# EAGLE schematic FV1 DSP pedal (EAGLE 9.3.0)
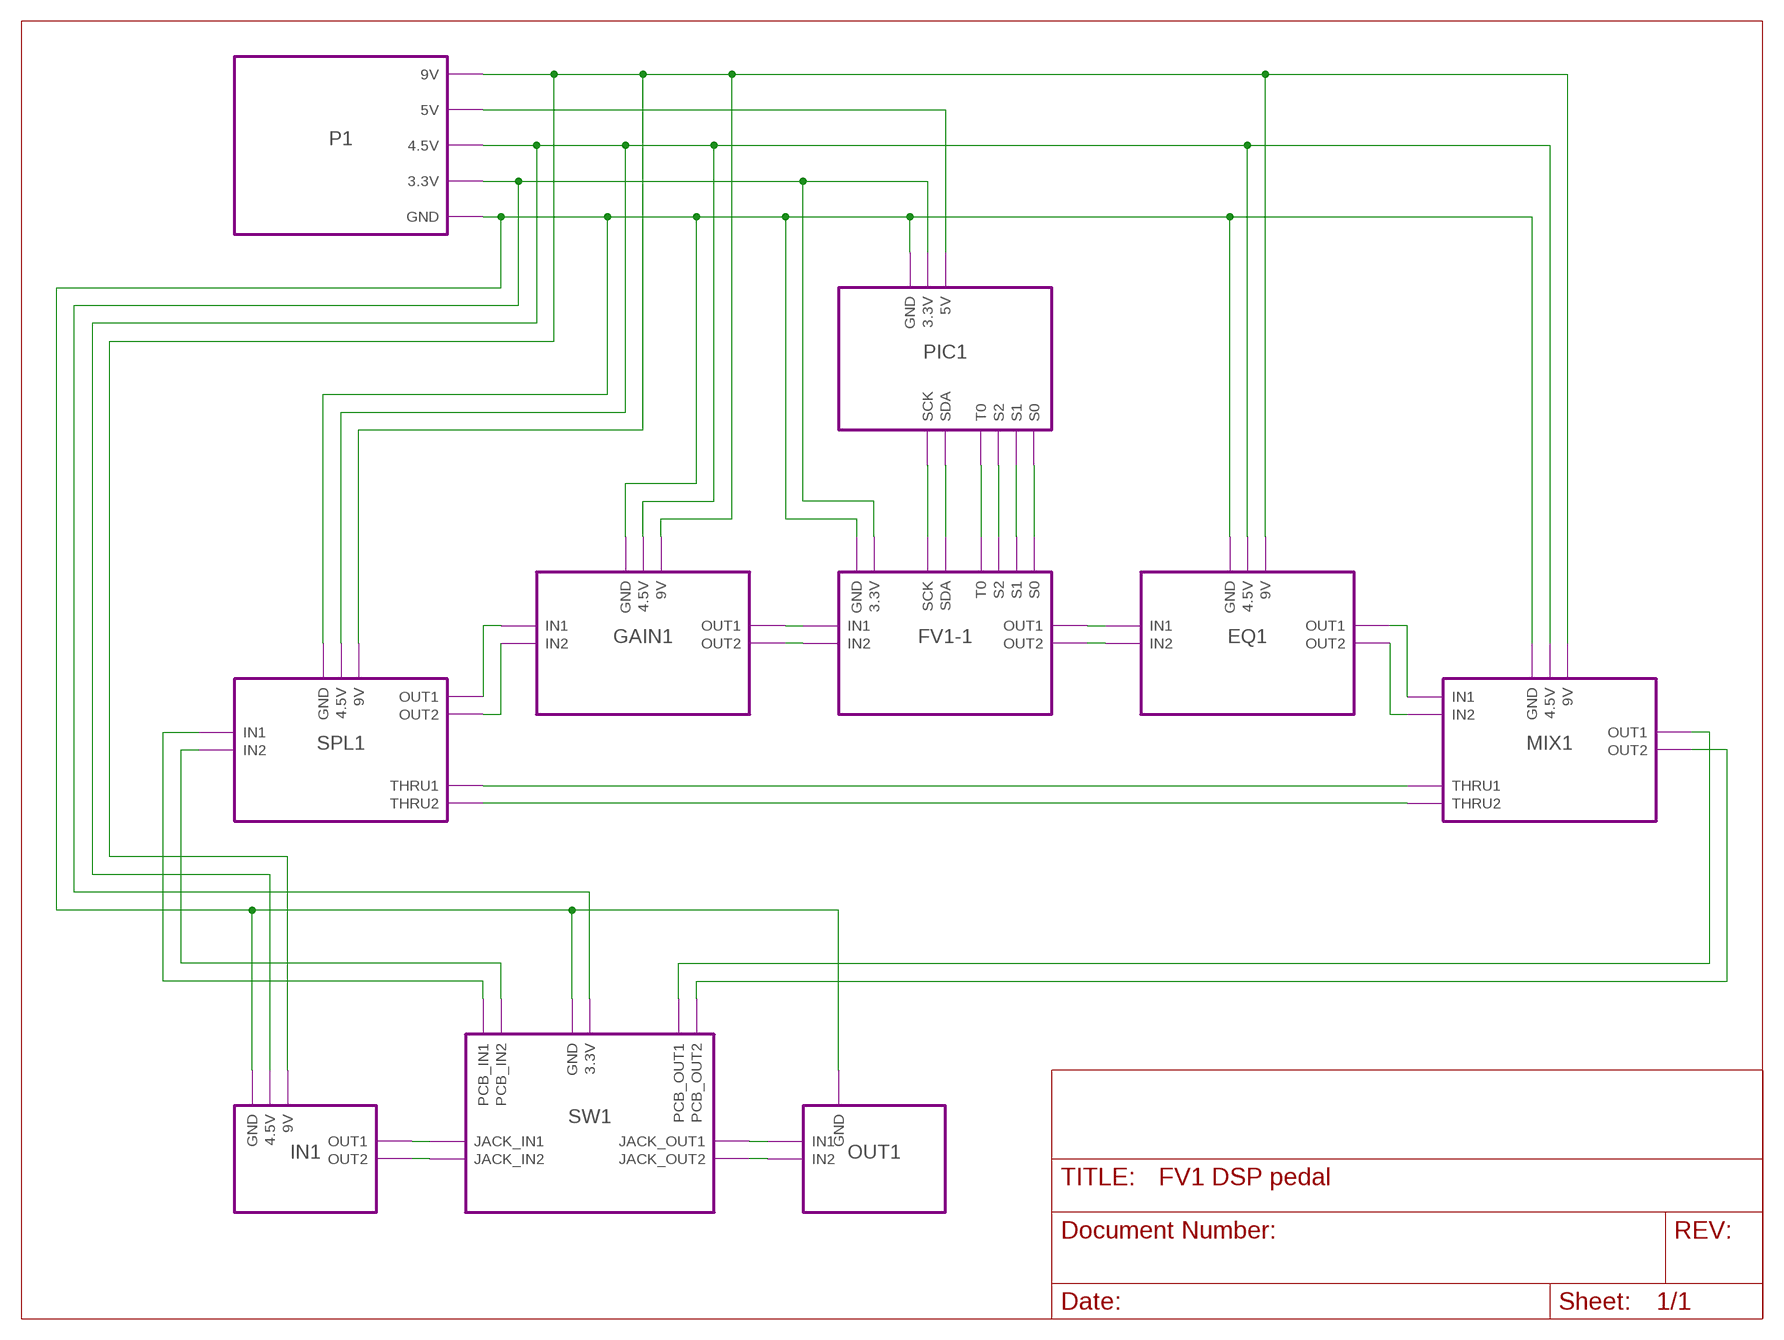
[diagram p0: schematic, sheet 1]

## Module instances
EQ1 = EQ
FV1-1 = FV1
PIC1 = PIC
MIX1 = MIX
GAIN1 = GAIN
OUT1 = OUTPUT
P1 = POWER
SW1 = SWITCHING
IN1 = INPUT
SPL1 = SPLIT

## Nets
3.3V: port SW1.3.3V P1.3.3V PIC1.3.3V FV1-1.3.3V
4.5V: port P1.4.5V MIX1.4.5V EQ1.4.5V SPL1.4.5V IN1.4.5V GAIN1.4.5V
9V: port P1.9V MIX1.9V EQ1.9V SPL1.9V IN1.9V GAIN1.9V
GND: port SW1.GND P1.GND PIC1.GND MIX1.GND EQ1.GND SPL1.GND FV1-1.GND IN1.GND GAIN1.GND OUT1.GND
N$1: port MIX1.THRU1 SPL1.THRU1
N$2: port MIX1.THRU2 SPL1.THRU2
N$3: port MIX1.IN1 EQ1.OUT1
N$4: port EQ1.OUT2 MIX1.IN2
N$5: port SPL1.OUT2 GAIN1.IN2
N$6: port GAIN1.IN1 SPL1.OUT1
N$7: port IN1.OUT1 SW1.JACK_IN1
N$8: port GAIN1.OUT1 FV1-1.IN1
N$9: port FV1-1.IN2 GAIN1.OUT2
N$10: port FV1-1.OUT1 EQ1.IN1
N$11: port EQ1.IN2 FV1-1.OUT2
N$12: port SW1.JACK_IN2 IN1.OUT2
N$13: port SW1.JACK_OUT1 OUT1.IN1
N$14: port OUT1.IN2 SW1.JACK_OUT2
N$15: port P1.5V PIC1.5V
N$17: port SW1.PCB_IN1 SPL1.IN1
N$18: port SW1.PCB_IN2 SPL1.IN2
N$19: port MIX1.OUT2 SW1.PCB_OUT2
N$20: port SW1.PCB_OUT1 MIX1.OUT1
N$22: port PIC1.T0 FV1-1.T0
N$23: port PIC1.S2 FV1-1.S2
N$25: port FV1-1.S1 PIC1.S1
N$26: port PIC1.S0 FV1-1.S0
N$27: port PIC1.SCK FV1-1.SCK
N$28: port PIC1.SDA FV1-1.SDA

## Library data of the parts

## Module EQ
Ports: IN1(in) IN2(in) OUT1(out) OUT2(out) 9V(pwr) 4.5V(pwr) GND(pwr)
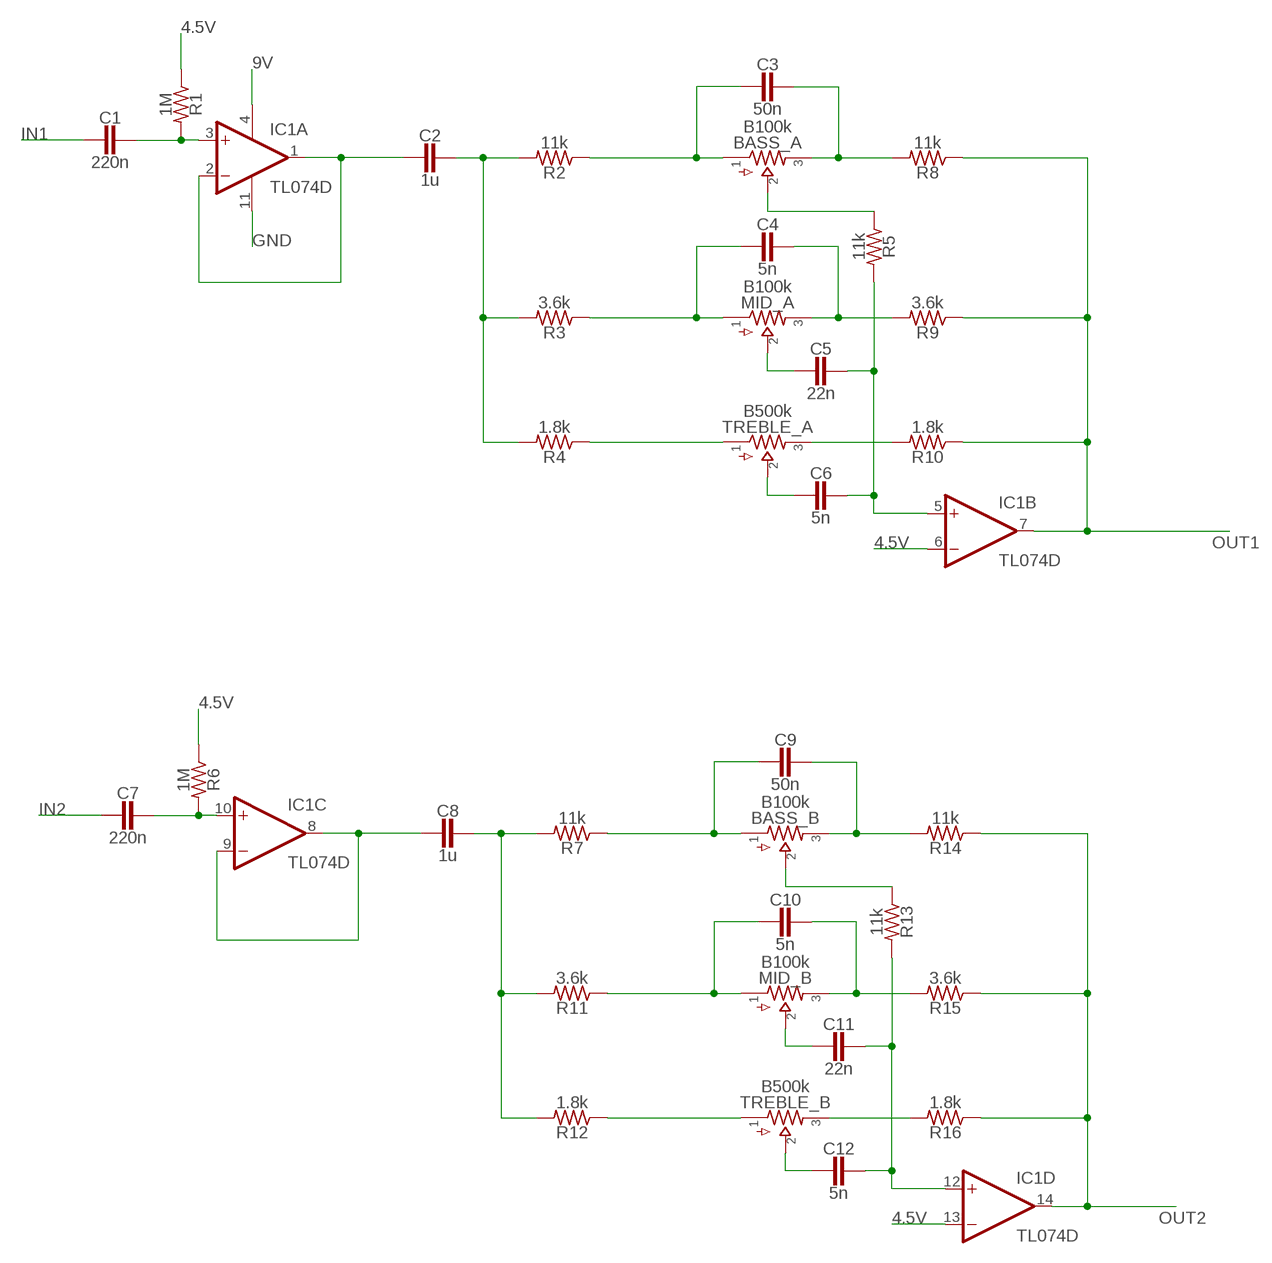
[diagram p1: schematic, module EQ, sheet 1]

### Parts
BASS  B100k  DUALGANG.2  [16MM_DUALGANG]
C1  220n  CAP0603  [RESISTOR_R0603]
C2  1u  CAP0603  [RESISTOR_R0603]
C3  50n  CAP0603  [RESISTOR_R0603]
C4  5n  CAP0603  [RESISTOR_R0603]
C5  22n  CAP0603  [RESISTOR_R0603]
C6  5n  CAP0603  [RESISTOR_R0603]
C7  220n  CAP0603  [RESISTOR_R0603]
C8  1u  CAP0603  [RESISTOR_R0603]
C9  50n  CAP0603  [RESISTOR_R0603]
C10  5n  CAP0603  [RESISTOR_R0603]
C11  22n  CAP0603  [RESISTOR_R0603]
C12  5n  CAP0603  [RESISTOR_R0603]
IC1  TL074D  [SO14]
MID  B100k  DUALGANG.2  [16MM_DUALGANG]
R1  1M  RESISTOR0603  [RESISTOR_R0603]
R2  11k  RESISTOR0603  [RESISTOR_R0603]
R3  3.6k  RESISTOR0603  [RESISTOR_R0603]
R4  1.8k  RESISTOR0603  [RESISTOR_R0603]
R5  11k  RESISTOR0603  [RESISTOR_R0603]
R6  1M  RESISTOR0603  [RESISTOR_R0603]
R7  11k  RESISTOR0603  [RESISTOR_R0603]
R8  11k  RESISTOR0603  [RESISTOR_R0603]
R9  3.6k  RESISTOR0603  [RESISTOR_R0603]
R10  1.8k  RESISTOR0603  [RESISTOR_R0603]
R11  3.6k  RESISTOR0603  [RESISTOR_R0603]
R12  1.8k  RESISTOR0603  [RESISTOR_R0603]
R13  11k  RESISTOR0603  [RESISTOR_R0603]
R14  11k  RESISTOR0603  [RESISTOR_R0603]
R15  3.6k  RESISTOR0603  [RESISTOR_R0603]
R16  1.8k  RESISTOR0603  [RESISTOR_R0603]
TREBLE  B500k  DUALGANG.2  [16MM_DUALGANG]

### Nets
4.5V: IC1.6(B:-IN) IC1.13(D:-IN) R1.1 R6.1
9V: IC1.4(P:V+)
GND: IC1.11(P:V-)
IN1: C1.2
IN2: C7.2
N$1: C7.1 IC1.10(C:+IN) R6.2
N$2: C2.2 IC1.1(A:OUT) IC1.2(A:-IN)
N$3: C2.1 R2.2 R3.2 R4.2
N$4: BASS.1 C3.2 R2.1
N$5: C4.2 MID.1 R3.1
N$6: R4.1 TREBLE.1
N$7: C4.1 MID.3 R9.2
N$8: R10.2 TREBLE.3
N$9: C1.1 IC1.3(A:+IN) R1.2
N$10: BASS.3 C3.1 R8.2
N$11: C5.1 C6.1 IC1.5(B:+IN) R5.2
N$12: C5.2 MID.2
N$13: C6.2 TREBLE.2
N$14: BASS.2 R5.1
N$16: C8.2 IC1.8(C:OUT) IC1.9(C:-IN)
N$17: C8.1 R7.2 R11.2 R12.2
N$18: BASS.4 C9.2 R7.1
N$19: C10.2 MID.4 R11.1
N$20: R12.1 TREBLE.4
N$21: C10.1 MID.6 R15.2
N$22: R16.2 TREBLE.6
N$23: BASS.6 C9.1 R14.2
N$25: C11.1 C12.1 IC1.12(D:+IN) R13.2
N$26: C11.2 MID.5
N$27: C12.2 TREBLE.5
N$28: BASS.5 R13.1
OUT1: IC1.7(B:OUT) R8.1 R9.1 R10.1
OUT2: IC1.14(D:OUT) R14.1 R15.1 R16.1

### Library data of the parts
BASS MID TREBLE = potentiometers:DUALGANG: Dual-Gan Potentiometers
C1-C12 = SMD:CAP
IC1 = linear:TL074: OP AMP
R1-R16 = SMD:RESISTOR

## Module MIX
Ports: IN1(in) IN2(in) THRU1(in) THRU2(in) OUT1(out) OUT2(out) 9V(pwr) 4.5V(pwr) GND(pwr)
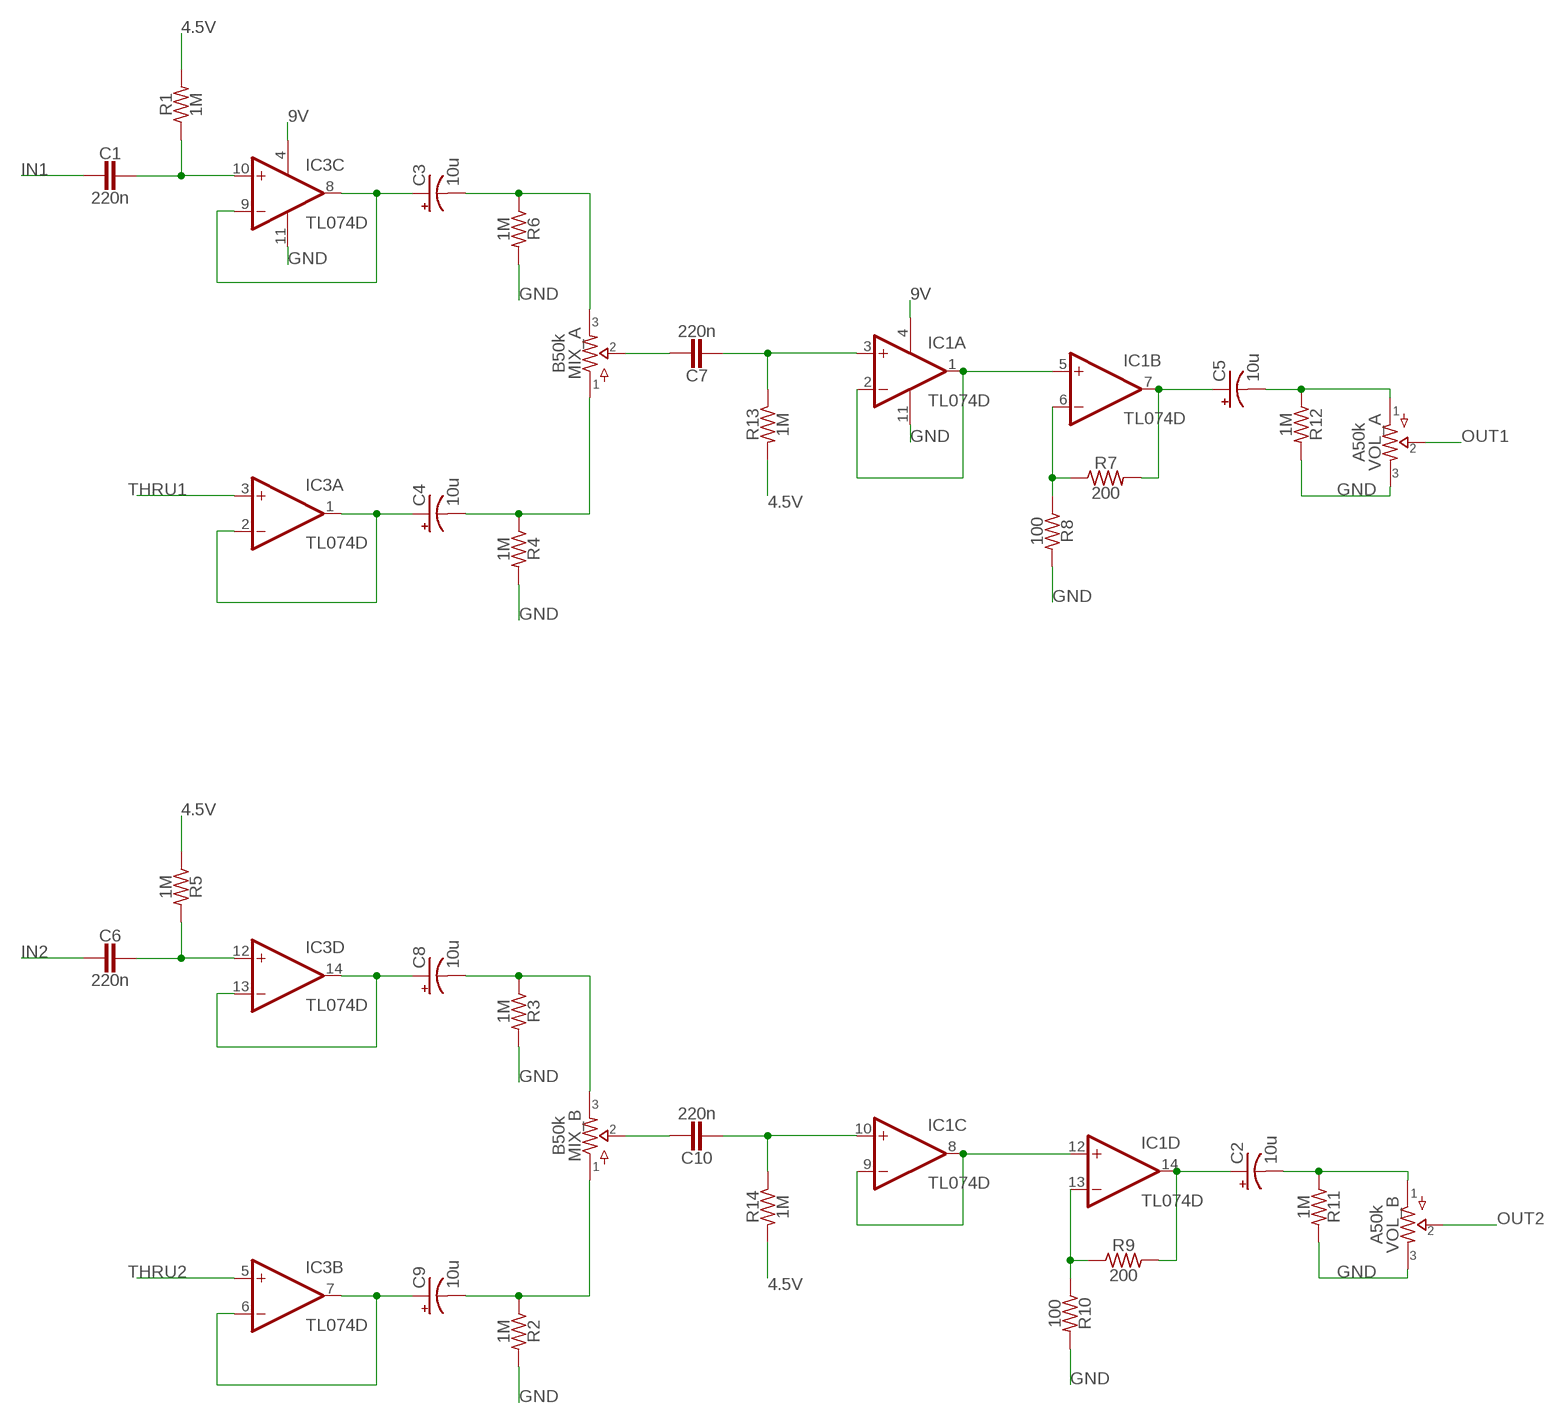
[diagram p2: schematic, module MIX, sheet 1]

### Parts
C1  220n  CAP0603  [RESISTOR_R0603]
C2  10u  CPOL-USUD-4X5,8  [UD-4X5,8_NICHICON]
C3  10u  CPOL-USUD-4X5,8  [UD-4X5,8_NICHICON]
C4  10u  CPOL-USUD-4X5,8  [UD-4X5,8_NICHICON]
C5  10u  CPOL-USUD-4X5,8  [UD-4X5,8_NICHICON]
C6  220n  CAP0603  [RESISTOR_R0603]
C7  220n  CAP0603  [RESISTOR_R0603]
C8  10u  CPOL-USUD-4X5,8  [UD-4X5,8_NICHICON]
C9  10u  CPOL-USUD-4X5,8  [UD-4X5,8_NICHICON]
C10  220n  CAP0603  [RESISTOR_R0603]
IC1  TL074D  [SO14]
IC3  TL074D  [SO14]
MIX  B50k  DUALGANG.2  [16MM_DUALGANG]
R1  1M  RESISTOR0603  [RESISTOR_R0603]
R2  1M  RESISTOR0603  [RESISTOR_R0603]
R3  1M  RESISTOR0603  [RESISTOR_R0603]
R4  1M  RESISTOR0603  [RESISTOR_R0603]
R5  1M  RESISTOR0603  [RESISTOR_R0603]
R6  1M  RESISTOR0603  [RESISTOR_R0603]
R7  200  RESISTOR0603  [RESISTOR_R0603]
R8  100  RESISTOR0603  [RESISTOR_R0603]
R9  200  RESISTOR0603  [RESISTOR_R0603]
R10  100  RESISTOR0603  [RESISTOR_R0603]
R11  1M  RESISTOR0603  [RESISTOR_R0603]
R12  1M  RESISTOR0603  [RESISTOR_R0603]
R13  1M  RESISTOR0603  [RESISTOR_R0603]
R14  1M  RESISTOR0603  [RESISTOR_R0603]
VOL  A50k  DUALGANG.2  [16MM_DUALGANG]

### Nets
4.5V: R1.2 R5.1 R13.2 R14.2
9V: IC1.4(P:V+) IC3.4(P:V+)
GND: IC1.11(P:V-) IC3.11(P:V-) R2.2 R3.2 R4.2 R6.2 R8.2 R10.2 R11.2 R12.2 VOL.3 VOL.6
IN1: C1.2
IN2: C6.2
N$1: C4.- MIX.1 R4.1
N$2: IC1.8(C:OUT) IC1.9(C:-IN) IC1.12(D:+IN)
N$3: IC1.13(D:-IN) R9.1 R10.1
N$4: C2.+ IC1.14(D:OUT) R9.2
N$5: C3.- MIX.3 R6.1
N$6: C7.1 IC1.3(A:+IN) R13.1
N$7: C4.+ IC3.1(A:OUT) IC3.2(A:-IN)
N$8: C3.+ IC3.8(C:OUT) IC3.9(C:-IN)
N$9: C10.1 IC1.10(C:+IN) R14.1
N$10: C10.2 MIX.5
N$11: C7.2 MIX.2
N$13: C9.- MIX.4 R2.1
N$14: C6.1 IC3.12(D:+IN) R5.2
N$15: C1.1 IC3.10(C:+IN) R1.1
N$18: C9.+ IC3.6(B:-IN) IC3.7(B:OUT)
N$19: IC1.1(A:OUT) IC1.2(A:-IN) IC1.5(B:+IN)
N$20: C8.- MIX.6 R3.1
N$21: C8.+ IC3.13(D:-IN) IC3.14(D:OUT)
N$22: IC1.6(B:-IN) R7.1 R8.1
N$23: C5.+ IC1.7(B:OUT) R7.2
N$25: C2.- R11.1 VOL.4
N$28: C5.- R12.1 VOL.1
OUT1: VOL.2
OUT2: VOL.5
THRU1: IC3.3(A:+IN)
THRU2: IC3.5(B:+IN)

### Library data of the parts
C1 C6 C7 C10 = SMD:CAP
C2-C5 C8 C9 = rcl:CPOL-US: POLARIZED CAPACITOR, American symbol; SPICEPREFIX: C
IC1 IC3 = linear:TL074: OP AMP
MIX VOL = potentiometers:DUALGANG: Dual-Gan Potentiometers
R1-R14 = SMD:RESISTOR

## Module FV1
Ports: IN1(in) IN2(in) OUT1(out) OUT2(out) 3.3V(pwr) GND(pwr) S0(io) S1(io) S2(io) T0(io) SDA(io) SCK(io)
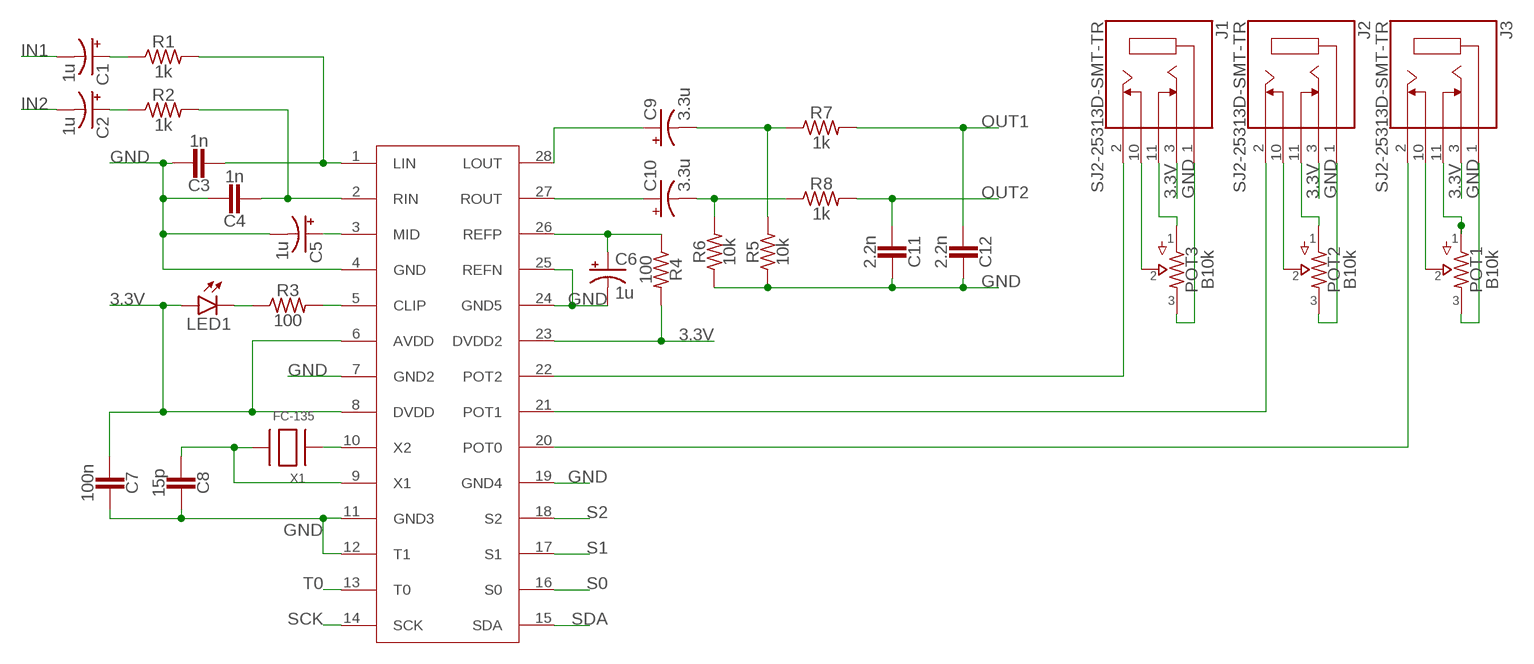
[diagram p3: schematic, module FV1, sheet 1]

### Parts
C1  1u  CPOL-USUD-4X5,8  [UD-4X5,8_NICHICON]
C2  1u  CPOL-USUD-4X5,8  [UD-4X5,8_NICHICON]
C3  1n  CAP0603  [RESISTOR_R0603]
C4  1n  CAP0603  [RESISTOR_R0603]
C5  1u  CPOL-USUD-4X5,8  [UD-4X5,8_NICHICON]
C6  1u  CPOL-USUD-4X5,8  [UD-4X5,8_NICHICON]
C7  100n  CAP0603  [RESISTOR_R0603]
C8  15p  CAP0603  [RESISTOR_R0603]
C9  3.3u  CPOL-USUD-4X5,8  [UD-4X5,8_NICHICON]
C10  3.3u  CPOL-USUD-4X5,8  [UD-4X5,8_NICHICON]
C11  2.2n  CAP0603  [RESISTOR_R0603]
C12  2.2n  CAP0603  [RESISTOR_R0603]
J1  SJ2-25313D-SMT-TR  [CUI_SJ2-25313D-SMT-TR]
J2  SJ2-25313D-SMT-TR  [CUI_SJ2-25313D-SMT-TR]
J3  SJ2-25313D-SMT-TR  [CUI_SJ2-25313D-SMT-TR]
LED1  LED5MM  [LED5MM]
POT1  B10k  16MM.1  [16MM_B.MOUNT]
POT2  B10k  16MM.1  [16MM_B.MOUNT]
POT3  B10k  16MM.1  [16MM_B.MOUNT]
R1  1k  RESISTOR0603  [RESISTOR_R0603]
R2  1k  RESISTOR0603  [RESISTOR_R0603]
R3  100  RESISTOR0603  [RESISTOR_R0603]
R4  100  RESISTOR0603  [RESISTOR_R0603]
R5  10k  RESISTOR0603  [RESISTOR_R0603]
R6  10k  RESISTOR0603  [RESISTOR_R0603]
R7  1k  RESISTOR0603  [RESISTOR_R0603]
R8  1k  RESISTOR0603  [RESISTOR_R0603]
U1  FV-1SMD  [SO28W]
X1  FC-135  XTAL-3.2X1.5  [XTAL3215]

### Nets
3.3V: C7.2 J1.3 J2.3 J3.3 LED1.A R4.2 U1.6(AVDD) U1.8(DVDD) U1.23(DVDD2)
GND: C3.1 C4.1 C5.- C6.- C7.1 C8.1 C11.1 C12.1 J1.1 J2.1 J3.1 POT1.3 POT2.3 POT3.3 R5.1 R6.1 U1.4(GND) U1.7(GND2) U1.11(GND3) U1.12(T1) U1.19(GND4) U1.24(GND5) U1.25(REFN)
IN1: C1.-
IN2: C2.-
N$1: J1.11 POT3.1
N$2: J1.10 POT3.2
N$3: J1.2 U1.22(POT2)
N$4: C6.+ R4.1 U1.26(REFP)
N$5: LED1.K(C) R3.1
N$6: C1.+ R1.1
N$7: R3.2 U1.5(CLIP)
N$8: C9.+ U1.28(LOUT)
N$9: C2.+ R2.1
N$10: C3.2 R1.2 U1.1(LIN)
N$11: C4.2 R2.2 U1.2(RIN)
N$12: C5.+ U1.3(MID)
N$13: C8.2 U1.9(X1) X1.P$2
N$14: J2.10 POT2.2
N$15: J2.2 U1.21(POT1)
N$16: J2.11 POT2.1
N$17: J3.11 POT1.1
N$18: J3.10 POT1.2
N$19: J3.2 U1.20(POT0)
N$20: C10.+ U1.27(ROUT)
N$21: U1.10(X2) X1.P$1
N$22: C9.- R5.2 R7.1
N$23: C10.- R6.2 R8.1
OUT1: C12.2 R7.2
OUT2: C11.2 R8.2
S0: U1.16(S0)
S1: U1.17(S1)
S2: U1.18(S2)
SCK: U1.14(SCK)
SDA: U1.15(SDA)
T0: U1.13(T0)

### Library data of the parts
C1 C2 C5 C6 C9 C10 = rcl:CPOL-US: POLARIZED CAPACITOR, American symbol; SPICEPREFIX: C
C3 C4 C7 C8 C11 C12 = SMD:CAP
J1-J3 = SJ2-25313D-SMT-TR:SJ2-25313D-SMT-TR: 3 conductors, 2.5mm, SMT Audio Jack w/ 2 Switch; CUI_PURCHASE_URL: https://www.cuidevices.com/product/interconnect/connectors/audio-connectors/jacks/sj2-2531x-smt-series?utm_source=snapeda.com&utm_medium=referral&utm_campaign=snapedaBOM; DESCRIPTION: 2.5 mm, Stereo,Right Angle, Surface Mount _SMT_, Audio Jack Connector; DIGI-KEY_PART_NUMBER: CP-SJ2-25313D-SMT-CT-ND; DIGI-KEY_PURCHASE_URL: https://www.digikey.com/product-detail/en/cui-devices/SJ2-25313D-SMT-TR/CP-SJ2-25313D-SMT-CT-ND/6619379?utm_source=snapeda&utm_medium=aggregator&utm_campaign=symbol; MF: CUI Devices; MP: SJ2-25313D-SMT-TR; PACKAGE: None
LED1 = led:LED: LED
POT1-POT3 = potentiometers:16MM: 16mm Poteniometers
R1-R8 = SMD:RESISTOR
U1 = ethan:FV-1
X1 = adafruit:XTAL: Low cost SMT crystals, no capacitors included http://www.ladyada.net/library/eagle

## Module PIC
Ports: 3.3V(pwr) GND(pwr) S0(out) S1(out) S2(out) T0(out) SCK(io) SDA(io) 5V(pwr)
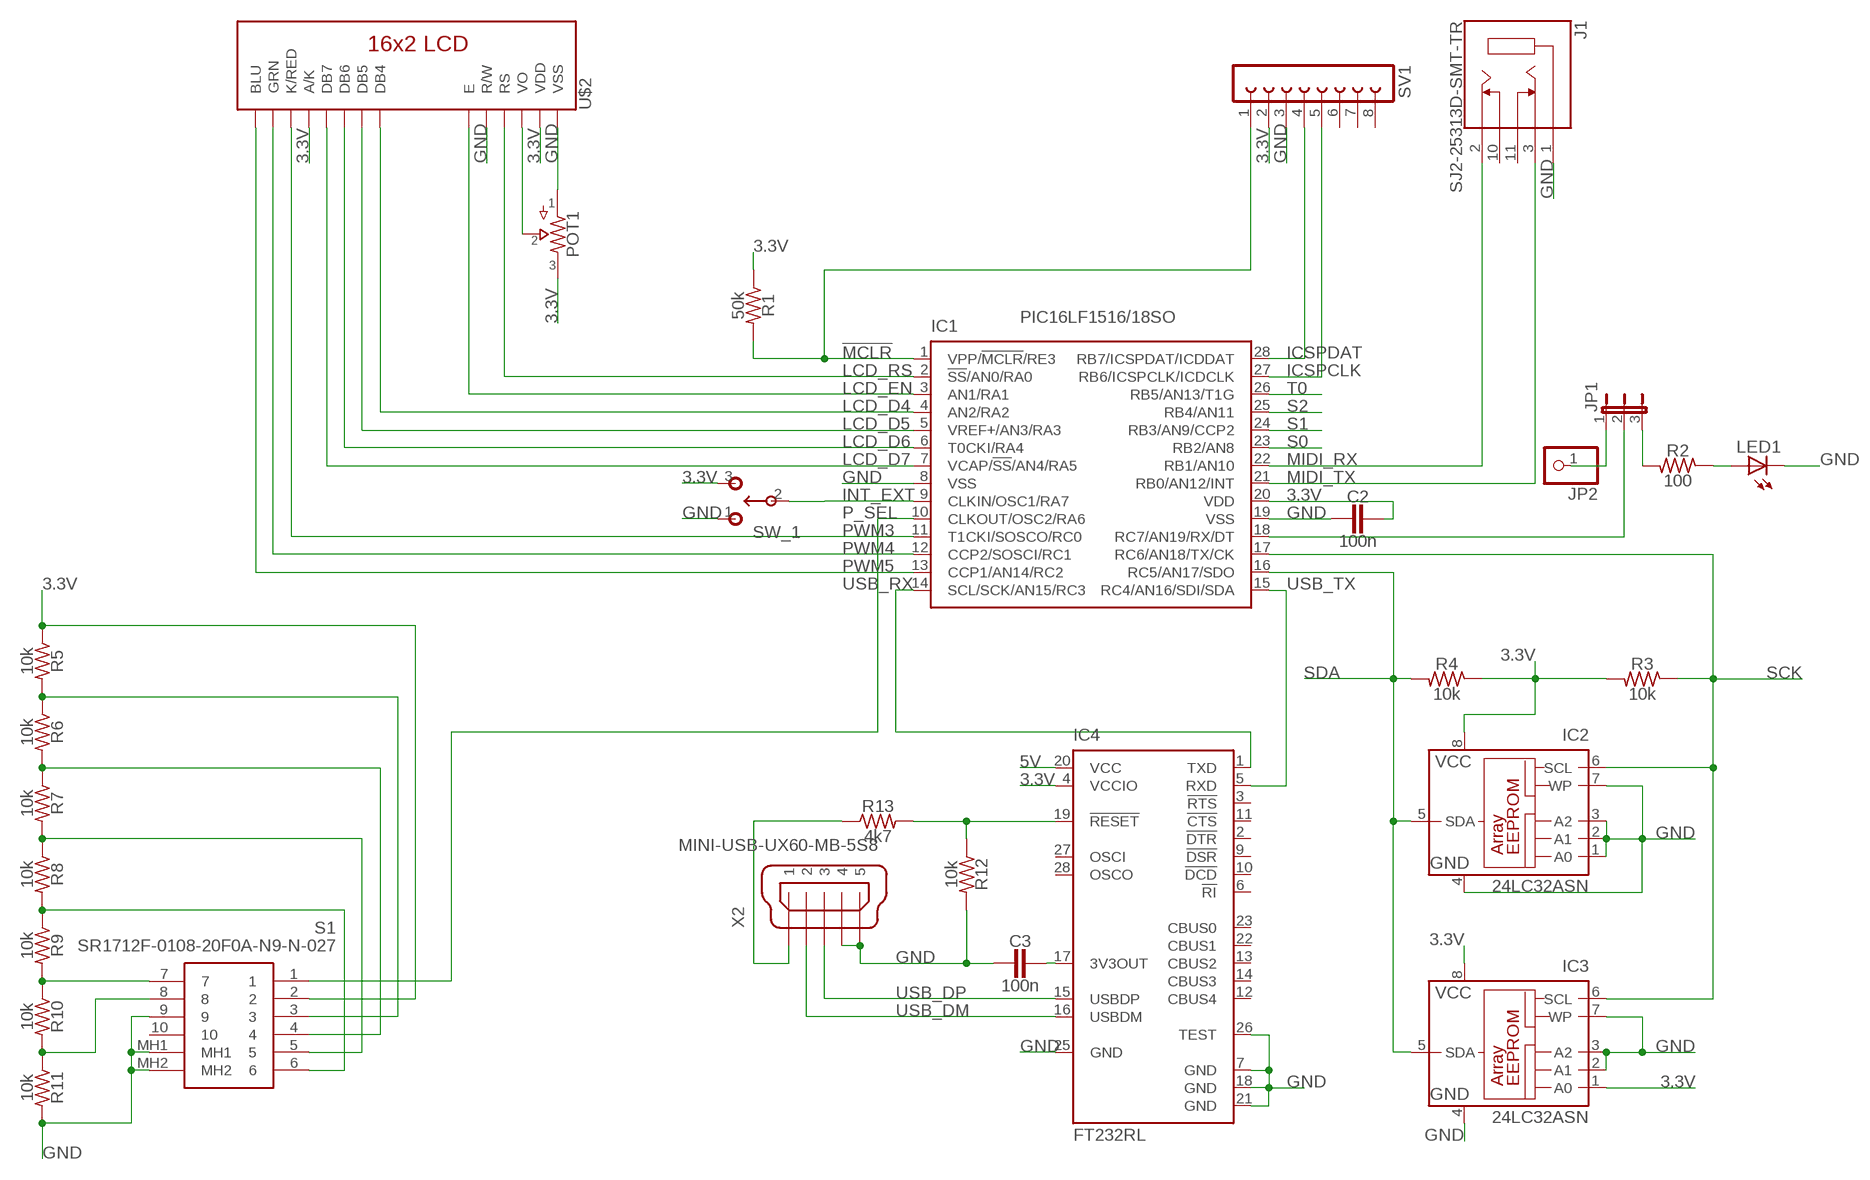
[diagram p4: schematic, module PIC, sheet 1]

### Parts
C2  100n  CAP0603  [RESISTOR_R0603]
C3  100n  CAP0603  [RESISTOR_R0603]
IC1  PIC16LF1516/18SO  [SO28W]
IC2  24LC32ASN  [SO-08]
IC3  24LC32ASN  [SO-08]
IC4  FT232RL  [SSOP28]
J1  SJ2-25313D-SMT-TR  [CUI_SJ2-25313D-SMT-TR]
JP1  JP2E  [JP2]
JP2  PINHD-1X1  [1X01]
LED1  LEDCHIPLED_1206  [CHIPLED_1206]
POT1  TRIMMER  [TRIM1]
R1  50k  RESISTOR0603  [RESISTOR_R0603]
R2  100  RESISTOR0603  [RESISTOR_R0603]
R3  10k  RESISTOR0603  [RESISTOR_R0603]
R4  10k  RESISTOR0603  [RESISTOR_R0603]
R5  10k  RESISTOR0603  [RESISTOR_R0603]
R6  10k  RESISTOR0603  [RESISTOR_R0603]
R7  10k  RESISTOR0603  [RESISTOR_R0603]
R8  10k  RESISTOR0603  [RESISTOR_R0603]
R9  10k  RESISTOR0603  [RESISTOR_R0603]
R10  10k  RESISTOR0603  [RESISTOR_R0603]
R11  10k  RESISTOR0603  [RESISTOR_R0603]
R12  10k  RESISTOR0603  [RESISTOR_R0603]
R13  4k7  RESISTOR0603  [RESISTOR_R0603]
S1  SR1712F-0108-20F0A-N9-N-027  [SR1712F010820F0AN9N027]
SV1  FE08-1  [FE08]
SW_1  SPDT.MINI  [SPDT.MINI]
U$2  LCD16X2RGB  [LCD16X2RGB]
X2  MINI-USB-UX60-MB-5S8  [UX60-MB-5S8]

### Nets
3.3V: C2.1 IC1.20(VDD) IC2.8(VCC) IC3.1(A0) IC3.8(VCC) IC4.4(VCCIO) POT1.3 R1.1 R3.2 R4.1 R5.1 S1.2 SV1.2 SW_1.3 U$2.2(VDD) U$2.15(A/K)
5V: IC4.20(VCC)
!MCLR: IC1.1(VPP/!MCLR!/RE3) R1.2 SV1.1
GND: C2.2 C3.2 IC1.8(VSS) IC1.19(VSS) IC2.1(A0) IC2.2(A1) IC2.3(A2) IC2.4(GND) IC2.7(WP) IC3.2(A1) IC3.3(A2) IC3.4(GND) IC3.7(WP) IC4.7(GND) IC4.18(GND) IC4.21(GND) IC4.25(GND) IC4.26(TEST) J1.1 LED1.C POT1.1 R11.2 R12.2 S1.9 S1.MH1 S1.MH2 SV1.3 SW_1.1 U$2.1(VSS) U$2.5(R/W) X2.4 X2.5
ICSPCLK: IC1.27(RB6/ICSPCLK/ICDCLK) SV1.5
ICSPDAT: IC1.28(RB7/ICSPDAT/ICDDAT) SV1.4
INT_EXT: IC1.9(CLKIN/OSC1/RA7) SW_1.2
LCD_D4: IC1.4(AN2/RA2) U$2.11(DB4)
LCD_D5: IC1.5(VREF+/AN3/RA3) U$2.12(DB5)
LCD_D6: IC1.6(T0CKI/RA4) U$2.13(DB6)
LCD_D7: IC1.7(VCAP/!SS!/AN4/RA5) U$2.14(DB7)
LCD_EN: IC1.3(AN1/RA1) U$2.6(E)
LCD_RS: IC1.2(!SS!/AN0/RA0) U$2.4(RS)
MIDI_RX: IC1.22(RB1/AN10) J1.2
MIDI_TX: IC1.21(RB0/AN12/INT) J1.3
N$1: IC1.18(RC7/AN19/RX/DT) JP1.2
N$2: JP1.1 JP2.1
N$3: C3.1 IC4.17(3V3OUT)
N$4: IC4.19(!RESET) R12.1 R13.2
N$5: JP1.3 R2.2
N$6: LED1.A R2.1
N$7: R13.1 X2.1
N$9: R5.2 R6.1 S1.3
N$10: R6.2 R7.1 S1.4
N$11: R7.2 R8.1 S1.5
N$12: R8.2 R9.1 S1.6
N$13: R9.2 R10.1 S1.7
N$14: R10.2 R11.1 S1.8
N$16: POT1.2 U$2.3(VO)
P_SEL: IC1.10(CLKOUT/OSC2/RA6) S1.1
PWM3: IC1.11(T1CKI/SOSCO/RC0) U$2.16(K/RED)
PWM4: IC1.12(CCP2/SOSCI/RC1) U$2.17(GRN)
PWM5: IC1.13(CCP1/AN14/RC2) U$2.18(BLU)
S0: IC1.23(RB2/AN8)
S1: IC1.24(RB3/AN9/CCP2)
S2: IC1.25(RB4/AN11)
SCK: IC1.17(RC6/AN18/TX/CK) IC2.6(SCL) IC3.6(SCL) R3.1
SDA: IC1.16(RC5/AN17/SDO) IC2.5(SDA) IC3.5(SDA) R4.2
T0: IC1.26(RB5/AN13/T1G)
USB_DM: IC4.16(USBDM) X2.2
USB_DP: IC4.15(USBDP) X2.3
USB_RX: IC1.14(SCL/SCK/AN15/RC3) IC4.1(TXD)
USB_TX: IC1.15(RC4/AN16/SDI/SDA) IC4.5(RXD)
Unconnected: IC4.2(!DTR) IC4.3(!RTS) IC4.6(!RI) IC4.9(!DSR) IC4.10(!DCD) IC4.11(!CTS) IC4.12(CBUS4) IC4.13(CBUS2) IC4.14(CBUS3) IC4.22(CBUS1) IC4.23(CBUS0) IC4.27(OSCI) IC4.28(OSCO) J1.10 J1.11 S1.10 SV1.6 SV1.7 SV1.8

### Library data of the parts
C2 C3 = SMD:CAP
IC1 = microchip:PIC16*F1516/18: 28/40/44-Pin Flash Microcontrollers with nanoWatt XLP Technology PIC16F1516/1518 AND PIC16LF1516/1518 Source: www.microchip.com PIC16F1516.pdf
IC2 IC3 = microchip:24*: Serial EEPROM I2C; MF: MICROCHIP; MPN: 24LC32A/SN; OC_FARNELL: 9758003; OC_NEWARK: 33C2976
IC4 = ftdichip:FT232R: Source: http://www.ftdichip.com/Documents/DataSheets/DS_FT232R_v104.pdf; MPN: FT232RL; OC_FARNELL: 1146032; OC_NEWARK: 91K9918
J1 = SJ2-25313D-SMT-TR:SJ2-25313D-SMT-TR: 3 conductors, 2.5mm, SMT Audio Jack w/ 2 Switch; CUI_PURCHASE_URL: https://www.cuidevices.com/product/interconnect/connectors/audio-connectors/jacks/sj2-2531x-smt-series?utm_source=snapeda.com&utm_medium=referral&utm_campaign=snapedaBOM; DESCRIPTION: 2.5 mm, Stereo,Right Angle, Surface Mount _SMT_, Audio Jack Connector; DIGI-KEY_PART_NUMBER: CP-SJ2-25313D-SMT-CT-ND; DIGI-KEY_PURCHASE_URL: https://www.digikey.com/product-detail/en/cui-devices/SJ2-25313D-SMT-TR/CP-SJ2-25313D-SMT-CT-ND/6619379?utm_source=snapeda&utm_medium=aggregator&utm_campaign=symbol; MF: CUI Devices; MP: SJ2-25313D-SMT-TR; PACKAGE: None
JP1 = jumper:JP2E: JUMPER
JP2 = pinhead:PINHD-1X1: PIN HEADER
LED1 = adafruit:LED: LED
POT1 = potentiometers:TRIMMER: Trimpots
R1-R13 = SMD:RESISTOR
S1 = SamacSys_Parts:SR1712F-0108-20F0A-N9-N-027: Rotary Switches 1 POLE 8 POS D SHAFT Source: Datasheet <http://www.taiwanalpha.com/english/p_e_141.htm>; DESCRIPTION: Rotary Switches 1 POLE 8 POS D SHAFT; HEIGHT: 27mm; MANUFACTURER_NAME: Alpha (Taiwan); MANUFACTURER_PART_NUMBER: SR1712F-0108-20F0A-N9-N-027; MOUSER_PART_NUMBER: 105-SR1712F-18NS; MOUSER_PRICE-STOCK: https://www.mouser.com/Search/Refine.aspx?Keyword=105-SR1712F-18NS
SV1 = con-lsta:FE08-1: FEMALE HEADER; OC_FARNELL: unknown; OC_NEWARK: unknown
SW_1 = switches:SPDT: SPDT Switches
U$2 = SparkFun-Displays-modified:LCD16X2RGB
X2 = con-hirose:MINI-USB-: MINI USB Connector Source: http://www.hirose.co.jp/cataloge_hp/e24000019.pdf; OC_FARNELL: unknown; OC_NEWARK: unknown

## Module GAIN
Ports: IN1(in) IN2(in) OUT1(out) OUT2(out) 9V(pwr) GND(pwr) 4.5V(pwr)
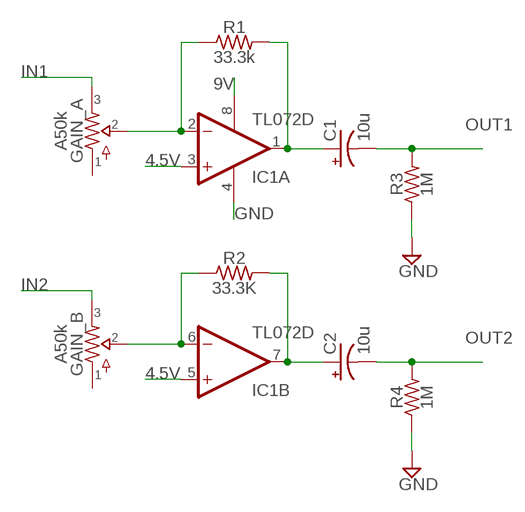
[diagram p5: schematic, module GAIN, sheet 1]

### Parts
C1  10u  CPOL-USUD-4X5,8  [UD-4X5,8_NICHICON]
C2  10u  CPOL-USUD-4X5,8  [UD-4X5,8_NICHICON]
GAIN  A50k  DUALGANG.2  [16MM_DUALGANG]
IC1  TL072D  [SO08]
R1  33.3k  RESISTOR0603  [RESISTOR_R0603]
R2  33.3K  RESISTOR0603  [RESISTOR_R0603]
R3  1M  RESISTOR0603  [RESISTOR_R0603]
R4  1M  RESISTOR0603  [RESISTOR_R0603]

### Nets
4.5V: IC1.3(A:+IN) IC1.5(B:+IN)
9V: IC1.8(P:V+)
GND: IC1.4(P:V-) R3.1 R4.1
IN1: GAIN.3
IN2: GAIN.6
N$1: C1.+ IC1.1(A:OUT) R1.2
N$2: C2.+ IC1.7(B:OUT) R2.2
N$3: GAIN.5 IC1.6(B:-IN) R2.1
N$4: GAIN.2 IC1.2(A:-IN) R1.1
OUT1: C1.- R3.2
OUT2: C2.- R4.2
Unconnected: GAIN.1 GAIN.4

### Library data of the parts
C1 C2 = rcl:CPOL-US: POLARIZED CAPACITOR, American symbol; SPICEPREFIX: C
GAIN = potentiometers:DUALGANG: Dual-Gan Potentiometers
IC1 = linear:TL072: OP AMP
R1-R4 = SMD:RESISTOR

## Module INPUT
Ports: OUT1(out) OUT2(out) GND(pwr) 4.5V(pwr) 9V(pwr)
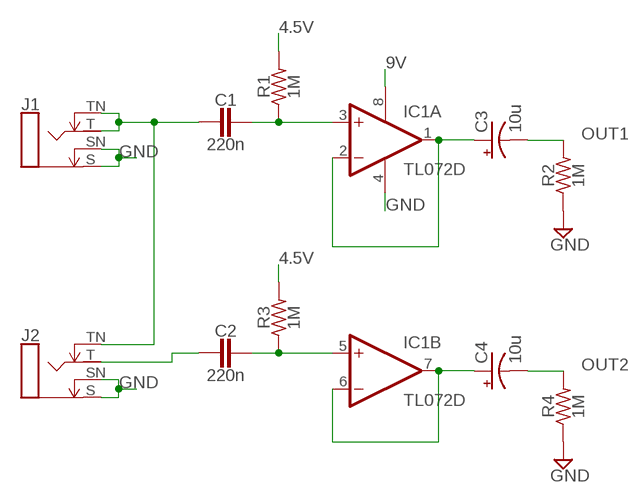
[diagram p6: schematic, module INPUT, sheet 1]

### Parts
C1  220n  CAP0603  [RESISTOR_R0603]
C2  220n  CAP0603  [RESISTOR_R0603]
C3  10u  CPOL-USUD-4X5,8  [UD-4X5,8_NICHICON]
C4  10u  CPOL-USUD-4X5,8  [UD-4X5,8_NICHICON]
IC1  TL072D  [SO08]
J1  SWITCHED_MONO_JACK  [TS_SW]
J2  SWITCHED_MONO_JACK  [TS_SW]
R1  1M  RESISTOR0603  [RESISTOR_R0603]
R2  1M  RESISTOR0603  [RESISTOR_R0603]
R3  1M  RESISTOR0603  [RESISTOR_R0603]
R4  1M  RESISTOR0603  [RESISTOR_R0603]

### Nets
4.5V: R1.2 R3.2
9V: IC1.8(P:V+)
GND: IC1.4(P:V-) J1.S J1.SN J2.S J2.SN R2.1 R4.1
N$1: C1.2 J1.T J1.TN J2.TN
N$3: C3.+ IC1.1(A:OUT) IC1.2(A:-IN)
N$5: C2.1 IC1.5(B:+IN) R3.1
N$6: C1.1 IC1.3(A:+IN) R1.1
N$7: C4.+ IC1.6(B:-IN) IC1.7(B:OUT)
N$8: C2.2 J2.T
OUT1: C3.- R2.2
OUT2: C4.- R4.2

### Library data of the parts
C1 C2 = SMD:CAP
C3 C4 = rcl:CPOL-US: POLARIZED CAPACITOR, American symbol; SPICEPREFIX: C
IC1 = linear:TL072: OP AMP
J1 J2 = jacks:SWITCHED_MONO: Mono TS Jack and wiring connections for switched applications 1/4" Marshall style (PCB Mount): http://smallbear-electronics.mybigcommerce.com/1-4-enclosed-nmj4hcd2/ 1/8" Jack (wired): http://smallbear-electronics.mybigcommerce.com/1-8-mono-pc-mount/
R1-R4 = SMD:RESISTOR

## Module OUTPUT
Ports: IN1(in) IN2(in) GND(pwr)
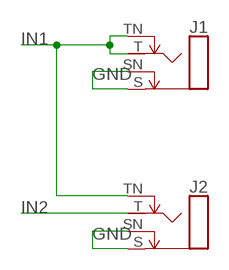
[diagram p7: schematic, module OUTPUT, sheet 1]

### Parts
J1  SWITCHED_MONO_JACK  [TS_SW]
J2  SWITCHED_MONO_JACK  [TS_SW]

### Nets
GND: J1.S J1.SN J2.S J2.SN
IN1: J1.T J1.TN J2.TN
IN2: J2.T

### Library data of the parts
J1 J2 = jacks:SWITCHED_MONO: Mono TS Jack and wiring connections for switched applications 1/4" Marshall style (PCB Mount): http://smallbear-electronics.mybigcommerce.com/1-4-enclosed-nmj4hcd2/ 1/8" Jack (wired): http://smallbear-electronics.mybigcommerce.com/1-8-mono-pc-mount/

## Module USB
Ports: 

### Library data of the parts

## Module MDI
Ports: 

### Library data of the parts

## Module POWER
Ports: GND(pwr) 3.3V(pwr) 4.5V(pwr) 9V(pwr) 5V(pwr)
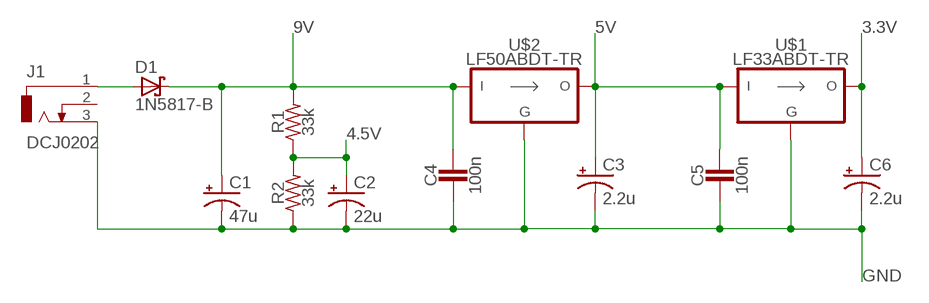
[diagram p8: schematic, module POWER, sheet 1]

### Parts
C1  47u  CPOL-USUD-6,3X5,8  [UD-6,3X5,8_NICHICON]
C2  22u  CPOL-USUD-5X5,8  [UD-5X5,8_NICHICON]
C3  2.2u  CPOL-USUD-4X5,8  [UD-4X5,8_NICHICON]
C4  100n  CAP0603  [RESISTOR_R0603]
C5  100n  CAP0603  [RESISTOR_R0603]
C6  2.2u  CPOL-USUD-4X5,8  [UD-4X5,8_NICHICON]
D1  1N5817-B  [DO41-7.6]
J1  DCJ0202  [DCJ0202]
R1  33k  RESISTOR0603  [RESISTOR_R0603]
R2  33k  RESISTOR0603  [RESISTOR_R0603]
U$1  LF33ABDT-TR  LM78._SMT  [TO252]
U$2  LF50ABDT-TR  LM78._SMT  [TO252]

### Nets
3.3V: C6.+ U$1.2(VO)
4.5V: C2.+ R1.1 R2.2
5V: C3.+ C5.1 U$1.1(VI) U$2.2(VO)
9V: C1.+ C4.1 D1.C R1.2 U$2.1(VI)
GND: C1.- C2.- C3.- C4.2 C5.2 C6.- J1.3 R2.1 U$1.3(GND) U$2.3(GND)
N$27: D1.A J1.1
Unconnected: J1.2

### Library data of the parts
C1-C3 C6 = rcl:CPOL-US: POLARIZED CAPACITOR, American symbol; SPICEPREFIX: C
C4 C5 = SMD:CAP
D1 = diode:1N581*: 1.0A SCHOTTKY BARRIER RECTIFIER Source: http://www.diodes.com/datasheets/ds23001.pdf
J1 = con-jack:DCJ0202: DC POWER JACK Source: DCJ0202.pdf; OC_FARNELL: unknown; OC_NEWARK: unknown
R1 R2 = SMD:RESISTOR
U$1 U$2 = regulators:LM78.: TO-220 Type, 1A LM7815: http://smallbear-electronics.mybigcommerce.com/ic-lm7815ct/

## Module SWITCHING
Ports: JACK_IN1(io) JACK_IN2(io) JACK_OUT1(out) JACK_OUT2(out) PCB_IN1(out) PCB_IN2(out) PCB_OUT1(io) PCB_OUT2(io) 3.3V(pwr) GND(pwr)
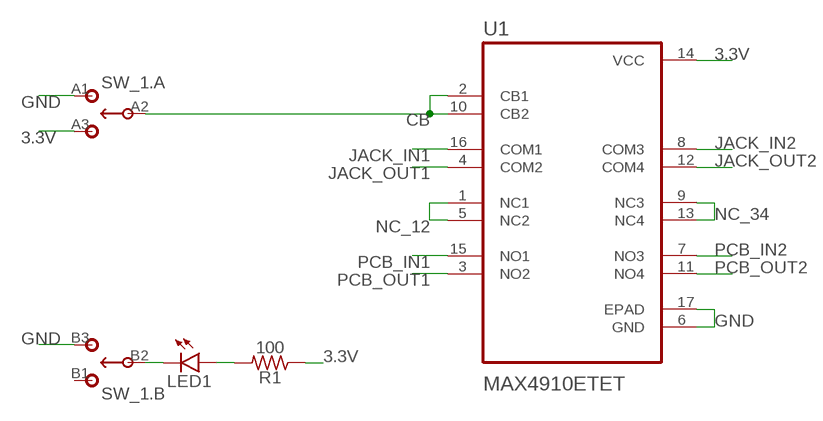
[diagram p9: schematic, module SWITCHING, sheet 1]

### Parts
LED1  LED5MM  [LED5MM]
R1  100  RESISTOR0603  [RESISTOR_R0603]
SW_1  DPDT.WIRE  [DPDT.WIRE]
U1  MAX4910ETET  [QFN50P300X300X80-17N]

### Nets
3.3V: R1.1 SW_1.A3 U1.14(VCC)
CB: SW_1.A2 U1.2(CB1) U1.10(CB2)
GND: SW_1.A1 SW_1.B3 U1.6(GND) U1.17(EPAD)
JACK_IN1: U1.16(COM1)
JACK_IN2: U1.8(COM3)
JACK_OUT1: U1.4(COM2)
JACK_OUT2: U1.12(COM4)
N$1: LED1.K(C) SW_1.B2
N$5: LED1.A R1.2
NC_12: U1.1(NC1) U1.5(NC2)
NC_34: U1.9(NC3) U1.13(NC4)
PCB_IN1: U1.15(NO1)
PCB_IN2: U1.7(NO3)
PCB_OUT1: U1.3(NO2)
PCB_OUT2: U1.11(NO4)
Unconnected: SW_1.B1

### Library data of the parts
LED1 = led:LED: LED
R1 = SMD:RESISTOR
SW_1 = switches:DPDT: DPDT Switches
U1 = MAX4910ETET:MAX4910ETET; DESCRIPTION: Interface IC - analogue switches Maxim Integrated MAX4910ETE+ TQFN 16 EP; DIGI-KEY_PART_NUMBER: MAX4910ETE+-ND; DIGI-KEY_PURCHASE_URL: https://www.digikey.com/product-detail/en/maxim-integrated/MAX4910ETE-/MAX4910ETE--ND/1779955?utm_source=snapeda&utm_medium=aggregator&utm_campaign=symbol; MF: Maxim Integrated; MP: MAX4910ETE+; PACKAGE: TQFN-16 Maxim

## Module SPLIT
Ports: THRU1(out) THRU2(out) OUT1(out) OUT2(out) IN1(in) IN2(in) 9V(pwr) 4.5V(pwr) GND(pwr)
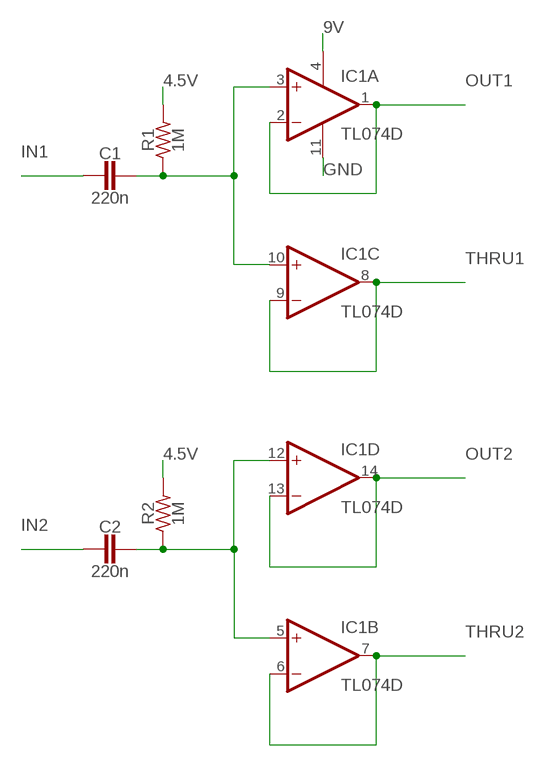
[diagram p10: schematic, module SPLIT, sheet 1]

### Parts
C1  220n  CAP0603  [RESISTOR_R0603]
C2  220n  CAP0603  [RESISTOR_R0603]
IC1  TL074D  [SO14]
R1  1M  RESISTOR0603  [RESISTOR_R0603]
R2  1M  RESISTOR0603  [RESISTOR_R0603]

### Nets
4.5V: R1.2 R2.2
9V: IC1.4(P:V+)
GND: IC1.11(P:V-)
IN1: C1.2
IN2: C2.2
N$3: C2.1 IC1.5(B:+IN) IC1.12(D:+IN) R2.1
N$5: C1.1 IC1.3(A:+IN) IC1.10(C:+IN) R1.1
OUT1: IC1.1(A:OUT) IC1.2(A:-IN)
OUT2: IC1.13(D:-IN) IC1.14(D:OUT)
THRU1: IC1.8(C:OUT) IC1.9(C:-IN)
THRU2: IC1.6(B:-IN) IC1.7(B:OUT)

### Library data of the parts
C1 C2 = SMD:CAP
IC1 = linear:TL074: OP AMP
R1 R2 = SMD:RESISTOR